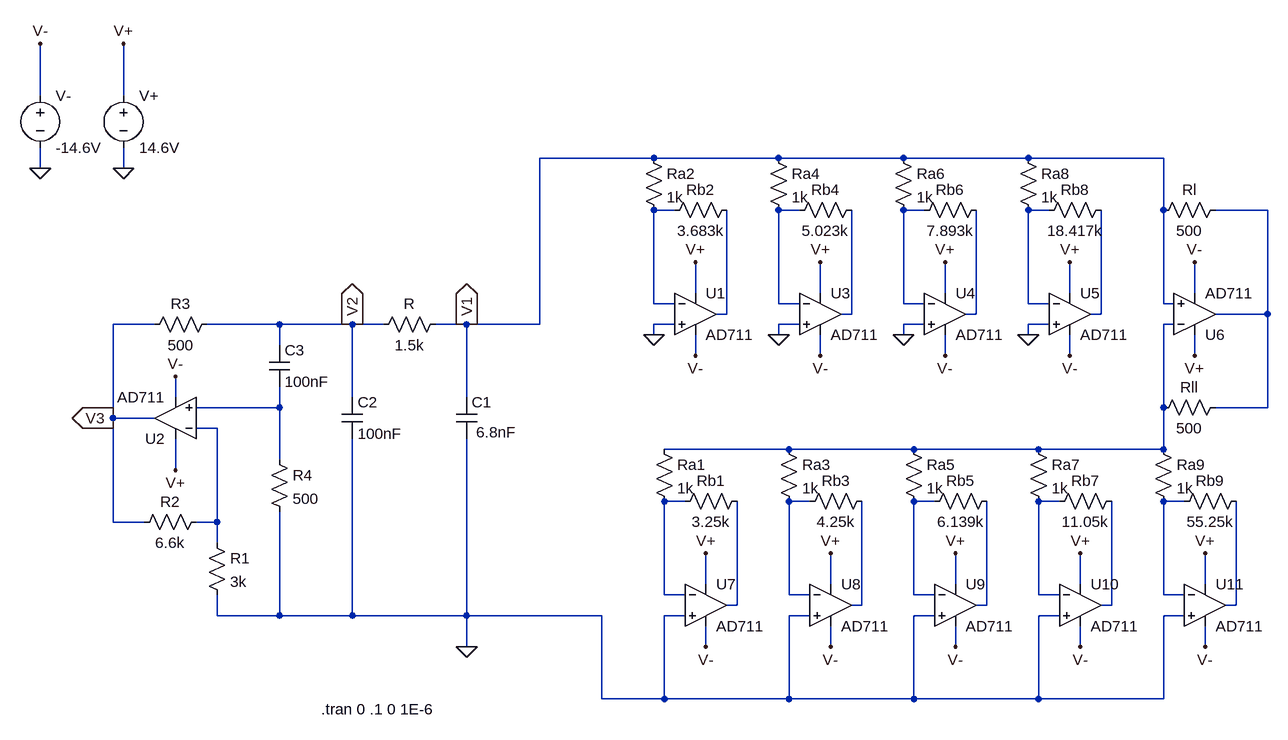
[diagram p0: schematic 2. Multiscroll .asc]
2. Multiscroll .asc, the LTspice schematic file:
Version 4
SHEET 1 924 2032
WIRE -2224 -416 -2224 -496
WIRE -2096 -416 -2096 -496
WIRE -1280 -320 -1456 -320
WIRE -1088 -320 -1280 -320
WIRE -896 -320 -1088 -320
WIRE -704 -320 -896 -320
WIRE -496 -320 -704 -320
WIRE -2224 -304 -2224 -336
WIRE -2096 -304 -2096 -336
WIRE -1248 -240 -1280 -240
WIRE -1056 -240 -1088 -240
WIRE -864 -240 -896 -240
WIRE -672 -240 -704 -240
WIRE -496 -240 -496 -320
WIRE -336 -240 -416 -240
WIRE -1216 -112 -1216 -160
WIRE -1024 -112 -1024 -160
WIRE -832 -112 -832 -160
WIRE -640 -112 -640 -160
WIRE -448 -112 -448 -160
WIRE -1280 -96 -1280 -240
WIRE -1248 -96 -1280 -96
WIRE -1088 -96 -1088 -240
WIRE -1056 -96 -1088 -96
WIRE -896 -96 -896 -240
WIRE -864 -96 -896 -96
WIRE -704 -96 -704 -240
WIRE -672 -96 -704 -96
WIRE -496 -96 -496 -240
WIRE -480 -96 -496 -96
WIRE -1168 -80 -1168 -240
WIRE -1168 -80 -1184 -80
WIRE -976 -80 -976 -240
WIRE -976 -80 -992 -80
WIRE -784 -80 -784 -240
WIRE -784 -80 -800 -80
WIRE -592 -80 -592 -240
WIRE -592 -80 -608 -80
WIRE -336 -80 -336 -240
WIRE -336 -80 -416 -80
WIRE -2048 -64 -2112 -64
WIRE -1856 -64 -1968 -64
WIRE -1744 -64 -1856 -64
WIRE -1696 -64 -1744 -64
WIRE -1568 -64 -1616 -64
WIRE -1456 -64 -1456 -320
WIRE -1456 -64 -1568 -64
WIRE -1248 -64 -1280 -64
WIRE -1056 -64 -1088 -64
WIRE -864 -64 -896 -64
WIRE -672 -64 -704 -64
WIRE -480 -64 -496 -64
WIRE -1280 -48 -1280 -64
WIRE -1088 -48 -1088 -64
WIRE -896 -48 -896 -64
WIRE -704 -48 -704 -64
WIRE -1856 -32 -1856 -64
WIRE -1216 -16 -1216 -48
WIRE -1024 -16 -1024 -48
WIRE -832 -16 -832 -48
WIRE -640 -16 -640 -48
WIRE -448 -16 -448 -48
WIRE -2016 48 -2016 16
WIRE -1744 48 -1744 -64
WIRE -1568 48 -1568 -64
WIRE -1856 64 -1856 32
WIRE -1856 64 -1984 64
WIRE -496 64 -496 -64
WIRE -336 64 -336 -80
WIRE -336 64 -416 64
WIRE -2112 80 -2112 -64
WIRE -2048 80 -2112 80
WIRE -1952 96 -1984 96
WIRE -1072 128 -1264 128
WIRE -880 128 -1072 128
WIRE -688 128 -880 128
WIRE -496 128 -496 64
WIRE -496 128 -688 128
WIRE -1856 144 -1856 64
WIRE -2016 160 -2016 112
WIRE -1232 208 -1264 208
WIRE -1040 208 -1072 208
WIRE -848 208 -880 208
WIRE -656 208 -688 208
WIRE -464 208 -496 208
WIRE -2112 240 -2112 80
WIRE -2064 240 -2112 240
WIRE -1952 240 -1952 96
WIRE -1952 240 -1984 240
WIRE -1952 272 -1952 240
WIRE -1200 336 -1200 288
WIRE -1008 336 -1008 288
WIRE -816 336 -816 288
WIRE -624 336 -624 288
WIRE -432 336 -432 288
WIRE -1264 352 -1264 208
WIRE -1232 352 -1264 352
WIRE -1072 352 -1072 208
WIRE -1040 352 -1072 352
WIRE -880 352 -880 208
WIRE -848 352 -880 352
WIRE -688 352 -688 208
WIRE -656 352 -688 352
WIRE -496 352 -496 208
WIRE -464 352 -496 352
WIRE -1152 368 -1152 208
WIRE -1152 368 -1168 368
WIRE -960 368 -960 208
WIRE -960 368 -976 368
WIRE -768 368 -768 208
WIRE -768 368 -784 368
WIRE -576 368 -576 208
WIRE -576 368 -592 368
WIRE -384 368 -384 208
WIRE -384 368 -400 368
WIRE -1952 384 -1952 352
WIRE -1856 384 -1856 224
WIRE -1856 384 -1952 384
WIRE -1744 384 -1744 112
WIRE -1744 384 -1856 384
WIRE -1568 384 -1568 112
WIRE -1568 384 -1744 384
WIRE -1360 384 -1568 384
WIRE -1232 384 -1264 384
WIRE -1040 384 -1072 384
WIRE -848 384 -880 384
WIRE -656 384 -688 384
WIRE -464 384 -496 384
WIRE -1568 432 -1568 384
WIRE -1200 432 -1200 400
WIRE -1008 432 -1008 400
WIRE -816 432 -816 400
WIRE -624 432 -624 400
WIRE -432 432 -432 400
WIRE -1360 512 -1360 384
WIRE -1264 512 -1264 384
WIRE -1264 512 -1360 512
WIRE -1072 512 -1072 384
WIRE -1072 512 -1264 512
WIRE -880 512 -880 384
WIRE -880 512 -1072 512
WIRE -688 512 -688 384
WIRE -688 512 -880 512
WIRE -496 512 -496 384
WIRE -496 512 -688 512
FLAG -2224 -304 0
FLAG -2096 -304 0
FLAG -2096 -496 V+
FLAG -2224 -496 V-
FLAG -2016 16 V-
FLAG -2016 160 V+
FLAG -1568 432 0
FLAG -2112 80 V3
IOPIN -2112 80 Out
FLAG -1744 -64 V2
IOPIN -1744 -64 Out
FLAG -1568 -64 V1
IOPIN -1568 -64 Out
FLAG -1216 -16 V-
FLAG -1216 -160 V+
FLAG -1024 -16 V-
FLAG -1024 -160 V+
FLAG -832 -16 V-
FLAG -832 -160 V+
FLAG -640 -16 V-
FLAG -640 -160 V+
FLAG -448 -16 V+
FLAG -448 -160 V-
FLAG -1200 432 V-
FLAG -1200 288 V+
FLAG -1008 432 V-
FLAG -1008 288 V+
FLAG -816 432 V-
FLAG -816 288 V+
FLAG -624 432 V-
FLAG -624 288 V+
FLAG -432 432 V-
FLAG -432 288 V+
FLAG -1280 -48 0
FLAG -1088 -48 0
FLAG -896 -48 0
FLAG -704 -48 0
SYMBOL voltage -2224 -432 R0
WINDOW 123 0 0 Left 2
WINDOW 39 24 124 Left 2
SYMATTR InstName V-
SYMATTR Value -14.6V
SYMBOL voltage -2096 -432 R0
WINDOW 123 0 0 Left 2
WINDOW 39 24 124 Left 2
SYMATTR InstName V+
SYMATTR Value 14.6V
SYMBOL res -1952 -80 R90
WINDOW 0 0 56 VBottom 2
WINDOW 3 32 56 VTop 2
SYMATTR InstName R3
SYMATTR Value 500
SYMBOL res -1968 224 R90
WINDOW 0 0 56 VBottom 2
WINDOW 3 32 56 VTop 2
SYMATTR InstName R2
SYMATTR Value 6.6k
SYMBOL cap -1760 48 R0
SYMATTR InstName C2
SYMATTR Value 100nF
SYMBOL cap -1584 48 R0
WINDOW 3 31 54 Left 2
SYMATTR Value 6.8nF
SYMATTR InstName C1
SYMBOL res -1600 -80 R90
WINDOW 0 0 56 VBottom 2
WINDOW 3 32 56 VTop 2
SYMATTR InstName R
SYMATTR Value 1.5k
SYMBOL res -1968 256 R0
SYMATTR InstName R1
SYMATTR Value 3k
SYMBOL AD711 -2016 144 R180
SYMATTR InstName U2
SYMBOL cap -1872 -32 R0
SYMATTR InstName C3
SYMATTR Value 100nF
SYMBOL res -1872 128 R0
SYMATTR InstName R4
SYMATTR Value 500
SYMBOL AD711 -1216 -144 R0
SYMATTR InstName U1
SYMBOL res -1296 -336 R0
SYMATTR InstName Ra2
SYMATTR Value 1k
SYMBOL res -1152 -256 R90
WINDOW 0 0 56 VBottom 2
WINDOW 3 32 56 VTop 2
SYMATTR InstName Rb2
SYMATTR Value 3.683k
SYMBOL AD711 -1024 -144 R0
SYMATTR InstName U3
SYMBOL res -1104 -336 R0
SYMATTR InstName Ra4
SYMATTR Value 1k
SYMBOL res -960 -256 R90
WINDOW 0 0 56 VBottom 2
WINDOW 3 32 56 VTop 2
SYMATTR InstName Rb4
SYMATTR Value 5.023k
SYMBOL AD711 -832 -144 R0
SYMATTR InstName U4
SYMBOL res -912 -336 R0
SYMATTR InstName Ra6
SYMATTR Value 1k
SYMBOL res -768 -256 R90
WINDOW 0 0 56 VBottom 2
WINDOW 3 32 56 VTop 2
SYMATTR InstName Rb6
SYMATTR Value 7.893k
SYMBOL AD711 -640 -144 R0
SYMATTR InstName U5
SYMBOL res -720 -336 R0
SYMATTR InstName Ra8
SYMATTR Value 1k
SYMBOL res -576 -256 R90
WINDOW 0 0 56 VBottom 2
WINDOW 3 32 56 VTop 2
SYMATTR InstName Rb8
SYMATTR Value 18.417k
SYMBOL AD711 -1200 304 R0
SYMATTR InstName U7
SYMBOL res -1280 112 R0
SYMATTR InstName Ra1
SYMATTR Value 1k
SYMBOL res -1136 192 R90
WINDOW 0 0 56 VBottom 2
WINDOW 3 32 56 VTop 2
SYMATTR InstName Rb1
SYMATTR Value 3.25k
SYMBOL AD711 -1008 304 R0
SYMATTR InstName U8
SYMBOL res -1088 112 R0
SYMATTR InstName Ra3
SYMATTR Value 1k
SYMBOL res -944 192 R90
WINDOW 0 0 56 VBottom 2
WINDOW 3 32 56 VTop 2
SYMATTR InstName Rb3
SYMATTR Value 4.25k
SYMBOL AD711 -816 304 R0
SYMATTR InstName U9
SYMBOL res -896 112 R0
SYMATTR InstName Ra5
SYMATTR Value 1k
SYMBOL res -752 192 R90
WINDOW 0 0 56 VBottom 2
WINDOW 3 32 56 VTop 2
SYMATTR InstName Rb5
SYMATTR Value 6.139k
SYMBOL AD711 -624 304 R0
SYMATTR InstName U10
SYMBOL res -704 112 R0
SYMATTR InstName Ra7
SYMATTR Value 1k
SYMBOL res -560 192 R90
WINDOW 0 0 56 VBottom 2
WINDOW 3 32 56 VTop 2
SYMATTR InstName Rb7
SYMATTR Value 11.05k
SYMBOL AD711 -432 304 R0
SYMATTR InstName U11
SYMBOL res -512 112 R0
SYMATTR InstName Ra9
SYMATTR Value 1k
SYMBOL res -368 192 R90
WINDOW 0 0 56 VBottom 2
WINDOW 3 32 56 VTop 2
SYMATTR InstName Rb9
SYMATTR Value 55.25k
SYMBOL res -400 -256 R90
WINDOW 0 0 56 VBottom 2
WINDOW 3 32 56 VTop 2
SYMATTR InstName Rl
SYMATTR Value 500
SYMBOL res -400 48 R90
WINDOW 0 0 56 VBottom 2
WINDOW 3 32 56 VTop 2
SYMATTR InstName Rll
SYMATTR Value 500
SYMBOL AD711 -448 -16 M180
SYMATTR InstName U6
TEXT -1792 528 Left 2 !.tran 0 .1 0 1E-6

The netlist it stands for:
* 2. Multiscroll .asc
V- V- 0 -14.6V
V+ V+ 0 14.6V
R3 V2 V3 500
R2 N012 V3 6.6k
C2 V2 0 100nF
C1 V1 0 6.8nF
R V1 V2 1.5k
R1 N012 0 3k
XU2 N011 N012 V+ V- V3 AD712  ; AD711, pins In+ In- V+ V- OUT
C3 V2 N011 100nF
R4 N011 0 500
XU1 0 N001 V+ V- N006 AD712  ; AD711, pins In+ In- V+ V- OUT
Ra2 V1 N001 1k
Rb2 N006 N001 3.683k
XU3 0 N002 V+ V- N007 AD712  ; AD711, pins In+ In- V+ V- OUT
Ra4 V1 N002 1k
Rb4 N007 N002 5.023k
XU4 0 N003 V+ V- N008 AD712  ; AD711, pins In+ In- V+ V- OUT
Ra6 V1 N003 1k
Rb6 N008 N003 7.893k
XU5 0 N004 V+ V- N009 AD712  ; AD711, pins In+ In- V+ V- OUT
Ra8 V1 N004 1k
Rb8 N009 N004 18.417k
XU7 0 N013 V+ V- N018 AD712  ; AD711, pins In+ In- V+ V- OUT
Ra1 N010 N013 1k
Rb1 N018 N013 3.25k
XU8 0 N014 V+ V- N019 AD712  ; AD711, pins In+ In- V+ V- OUT
Ra3 N010 N014 1k
Rb3 N019 N014 4.25k
XU9 0 N015 V+ V- N020 AD712  ; AD711, pins In+ In- V+ V- OUT
Ra5 N010 N015 1k
Rb5 N020 N015 6.139k
XU10 0 N016 V+ V- N021 AD712  ; AD711, pins In+ In- V+ V- OUT
Ra7 N010 N016 1k
Rb7 N021 N016 11.05k
XU11 0 N017 V+ V- N022 AD712  ; AD711, pins In+ In- V+ V- OUT
Ra9 N010 N017 1k
Rb9 N022 N017 55.25k
Rl N005 V1 500
Rll N005 N010 500
XU6 V1 N010 V+ V- N005 AD712  ; AD711, pins In+ In- V+ V- OUT
.tran 0 .1 0 1E-6
.lib ADI1.lib
.backanno
.end